# Altium schematic sheet Pin_Expansion.SchDoc
size A4; SheetNumber: 1; SheetTotal: 1
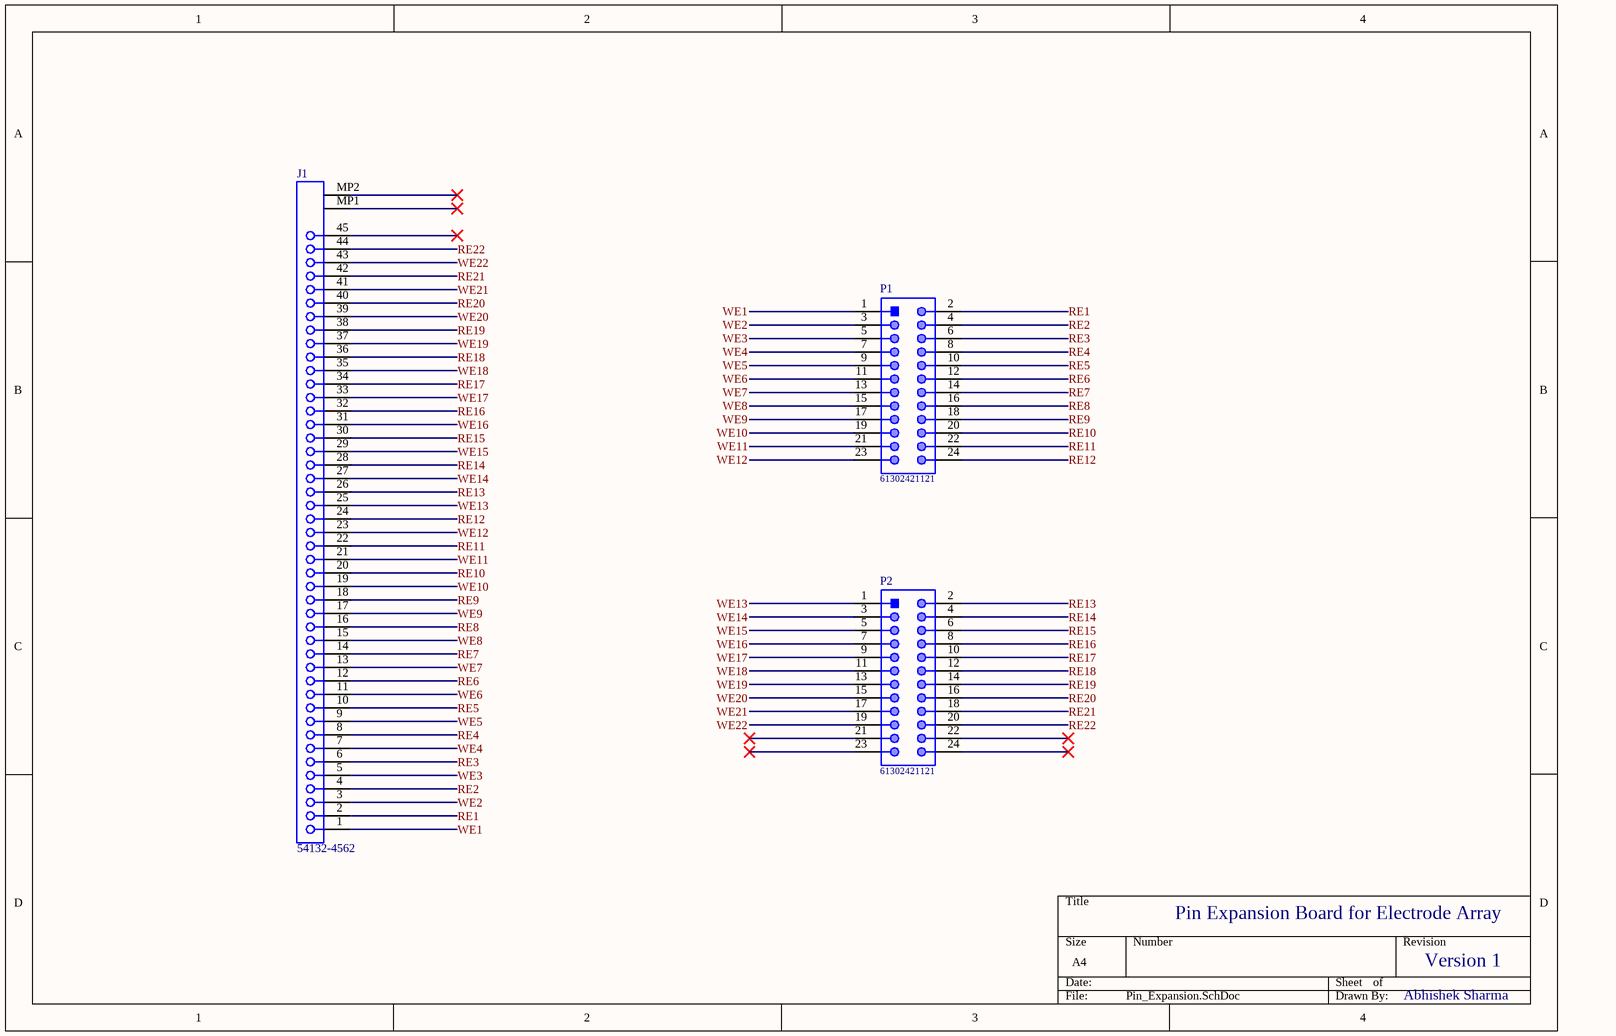
[diagram p0: Pin_Expansion.SchDoc]

## Parts
J1  54132-4562  [MOLX-54132-4562]
P1  61302421121  [61302421121]
P2  61302421121  [61302421121]

## Nets
RE1: J1.2 P1.2
RE2: J1.4 P1.4
RE3: J1.6 P1.6
RE4: J1.8 P1.8
RE5: J1.10 P1.10
RE6: J1.12 P1.12
RE7: J1.14 P1.14
RE8: J1.16 P1.16
RE9: J1.18 P1.18
RE10: J1.20 P1.20
RE11: J1.22 P1.22
RE12: J1.24 P1.24
RE13: J1.26 P2.2
RE14: J1.28 P2.4
RE15: J1.30 P2.6
RE16: J1.32 P2.8
RE17: J1.34 P2.10
RE18: J1.36 P2.12
RE19: J1.38 P2.14
RE20: J1.40 P2.16
RE21: J1.42 P2.18
RE22: J1.44 P2.20
WE1: J1.1 P1.1
WE2: J1.3 P1.3
WE3: J1.5 P1.5
WE4: J1.7 P1.7
WE5: J1.9 P1.9
WE6: J1.11 P1.11
WE7: J1.13 P1.13
WE8: J1.15 P1.15
WE9: J1.17 P1.17
WE10: J1.19 P1.19
WE11: J1.21 P1.21
WE12: J1.23 P1.23
WE13: J1.25 P2.1
WE14: J1.27 P2.3
WE15: J1.29 P2.5
WE16: J1.31 P2.7
WE17: J1.33 P2.9
WE18: J1.35 P2.11
WE19: J1.37 P2.13
WE20: J1.39 P2.15
WE21: J1.41 P2.17
WE22: J1.43 P2.19

Not connected (* = marked no-connect by the designer): J1 45* MP1* MP2*; P2 21* 22* 23* 24*

## Notes on the sheet
- Pin Expansion Board for Electrode Array
- Version 1
- Abhishek Sharma

## Library data of the parts
J1 = CMP-1241-00535-1: 0.5 mm Pitch Easy-On(TM) Type FPC Connector, 2.0 mm Mated Height, Right Angle, ZIF, SMT, Bottom Contact, 45 Circuits, -20 to 85 degC, ELV and RoHS Compliant, Tape and Reel; Manufacturer: Molex; PCB Retention: Yes; Material - Plating Termination: Gold; Mated Height: 2.00mm; Circuits (Loaded): 45; Stackable: No; Voltage (Max): 50V; Durability (mating cycles max): 20; Pitch - Mating Interface: 0.50mm; Current (Max per Contact): 0.5A; Entry Angle: 90degrees Angle; Material - Metal: Phosphor Bronze; ComponentLink1Description: Manufacturer URL; PackageVersion: Rev. F, 07/2010; ComponentLink3Description: Package Specification; Packing: Tape and Reel; PackageReference: 54132-4562; ComponentLink2Description: Datasheet; Material - Plating Mating: Gold; Contact Position: Bottom; PackageDescription: 45-Lead FPC Connector, Pitch 0.5 mm; ComponentLink1URL: http://www.molex.com/molex/index.jsp; Polarized to PCB: Yes; Mounting Technology: Surface Mount; RoHS: TRUE; PCB Locator: No; Number of Rows: 1; ComponentLink3URL: http://www.molex.com/pdm_docs/sd/541324562_sd.pdf; ComponentLink2URL: http://www.molex.com/webdocs/datasheets/pdf/en-us/0541324562_FFC_FPC_CONNECTORS.pdf; Orientation: Right Angle; PartNumber: 54132-4562
P1 P2 = CMP-1502-01111-1: THT Vertical Pin Header WR-PHD, Pitch 2.54 mm, Dual Row, 24 pins; Manufacturer: Wurth Elektronik; Contact Resistance: 20mOhm; Pitch: 2.54mm; Pin Number: 24; Withstanding Voltage: 500VAC; Rated Current: 3A; Gender: Male; Working Voltage: 250VAC; Publisher: WurthElektronik; Mounting Technology: THT; Orientation: Vertical; Part Number: 61302421121; Package Reference: 61302421121; Row Number: Dual; Manufacturer URL: http://www.we-online.de; Packaging: Bag; Operating Temperature: -40to105degC; Datasheet URL: https://katalog.we-online.de/em/datasheet/6130xx21121.pdf